# Altium schematic sheet [04]-Connector.SchDoc: ENTER SHEET TITLE
size B; Engineer: ENTER ENGINEER NAME; Organization: CUAir; Address1: L3, 12a Rodborough Rd; Address2: Frenchs Forest; Address3: NSW; Address4: Australia 2086; Revision: ENTER REVISION NUMBER; CompetitionYear: 2019; CPN: ENTER CPN; PROJECT: ENTER PROJECT NAME
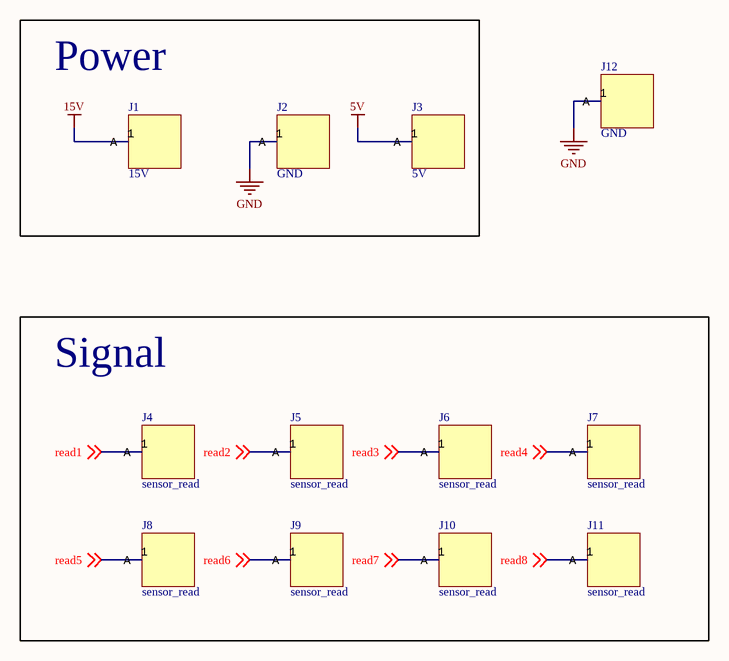
[diagram p0: [04]-Connector.SchDoc]

## Parts
J1  15V  [PIN]
J2  GND  [PIN]
J3  5V  [PIN]
J4  sensor_read  [PIN]
J5  sensor_read  [PIN]
J6  sensor_read  [PIN]
J7  sensor_read  [PIN]
J8  sensor_read  [PIN]
J9  sensor_read  [PIN]
J10  sensor_read  [PIN]
J11  sensor_read  [PIN]
J12  GND  [PIN]

## Blocks framed on the sheet
Power: J1-J3
Signal: J4-J11

## Nets
5V: J3.1(A)
15V: J1.1(A)
GND: J2.1(A) J12.1(A)
read1: J4.1(A) ; off-sheet read1
read2: J5.1(A) ; off-sheet read2
read3: J6.1(A) ; off-sheet read3
read4: J7.1(A) ; off-sheet read4
read5: J8.1(A) ; off-sheet read5
read6: J9.1(A) ; off-sheet read6
read7: J10.1(A) ; off-sheet read7
read8: J11.1(A) ; off-sheet read8

## Notes on the sheet
- Project
- Title
- Size:
- Date:
- B
- Number:
- Revision:
- File:

## Library data of the parts
J3 = 15V